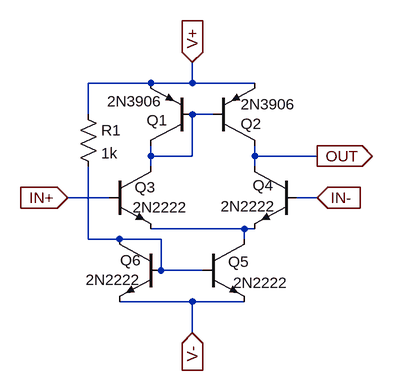
[diagram p0: schematic d30814x.asc]
d30814x.asc, the LTspice schematic file:
Version 4
SHEET 1 880 680
WIRE 48 64 -48 64
WIRE 112 64 112 32
WIRE 112 64 48 64
WIRE 208 64 112 64
WIRE -48 112 -48 64
WIRE 144 112 112 112
WIRE 48 176 48 160
WIRE 112 176 112 112
WIRE 112 176 48 176
WIRE 208 176 208 160
WIRE 304 176 208 176
WIRE 48 192 48 176
WIRE 208 192 208 176
WIRE -16 240 -80 240
WIRE 304 240 272 240
WIRE 192 288 48 288
WIRE 208 288 192 288
WIRE -48 304 -48 192
WIRE 0 304 -48 304
WIRE 64 304 0 304
WIRE 192 304 192 288
WIRE 64 352 64 304
WIRE 128 352 64 352
WIRE 112 400 0 400
WIRE 192 400 112 400
WIRE 112 448 112 400
FLAG -80 240 IN+
IOPIN -80 240 In
FLAG 304 240 IN-
IOPIN 304 240 In
FLAG 112 32 V+
IOPIN 112 32 In
FLAG 112 448 V-
IOPIN 112 448 In
FLAG 304 176 OUT
IOPIN 304 176 Out
SYMBOL pnp 112 160 R180
WINDOW 0 38 39 Left 2
WINDOW 3 46 68 Left 2
SYMATTR InstName Q1
SYMATTR Value 2N3906
SYMBOL pnp 144 160 M180
WINDOW 0 42 34 Left 2
WINDOW 3 42 64 Left 2
SYMATTR InstName Q2
SYMATTR Value 2N3906
SYMBOL npn -16 192 R0
WINDOW 0 39 32 Left 2
WINDOW 3 36 63 Left 2
SYMATTR InstName Q3
SYMATTR Value 2N2222
SYMBOL npn 272 192 M0
WINDOW 0 35 29 Left 2
WINDOW 3 32 61 Left 2
SYMATTR InstName Q4
SYMATTR Value 2N2222
SYMBOL npn 128 304 R0
WINDOW 0 39 35 Left 2
WINDOW 3 47 67 Left 2
SYMATTR InstName Q5
SYMATTR Value 2N2222
SYMBOL npn 64 304 M0
WINDOW 0 31 32 Left 2
WINDOW 3 31 62 Left 2
SYMATTR InstName Q6
SYMATTR Value 2N2222
SYMBOL res -64 96 R0
SYMATTR InstName R1
SYMATTR Value 1k

The netlist it stands for:
* d30814x.asc
Q1 N001 N001 V+ 0 2N3906
Q2 OUT N001 V+ 0 2N3906
Q3 N001 IN+ N002 0 2N2222
Q4 OUT IN- N002 0 2N2222
Q5 N002 N003 V- 0 2N2222
Q6 N003 N003 V- 0 2N2222
R1 V+ N003 1k
.model NPN NPN
.model PNP PNP
.lib standard.bjt
.backanno
.end